# Altium schematic sheet R-RJ45R08P-C0001_R-RJ45R08P-C000.schdoc
size 124 x 99 mm
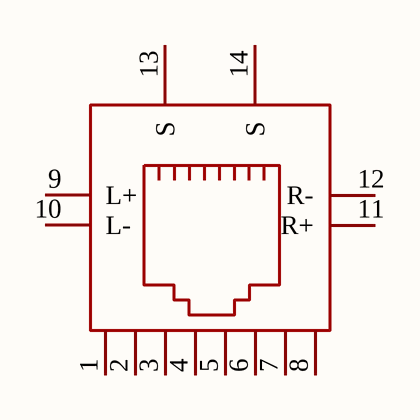
[diagram p0: R-RJ45R08P-C0001_R-RJ45R08P-C000.schdoc]

## Parts
RJ?  R-RJ45R08P-C000  [RJ45-TH_R-RJ45R08P-C000]  (value not drawn)

## Nets

Not connected (* = marked no-connect by the designer): RJ? 1 2 3 4 5 6 7 8 9(L+) 10(L-) 11(R+) 12(R-) 13(S) 14(S)

## Library data of the parts
RJ? = R-RJ45R08P-C000: Manufacturer: Ckmtw(灿科盟); Add into BOM: yes; Connector Type: RJ45插座; Number of Ports: 1; LED: 带LED; Shielding: 有屏蔽; Supplementary Features: 鱼叉脚(塑料); Symbol: R-RJ45R08P-C000; Device: R-RJ45R08P-C000; LCSC Part Name: 弯插 带LED; Supplier Part: C386757; Manufacturer Part: R-RJ45R08P-C000; Supplier Footprint: 插件; JLCPCB Part Class: Extended Part; Datasheet: https://item.szlcsc.com/datasheet/R-RJ45R08P-C000/360864.html; Supplier: LCSC; Convert to PCB: yes; Mounting Type: 弯插; Ratings: -; PoE: -; Contact Material: -; Contact Plating: -; Operating Temperature: 0℃~+70℃